# EAGLE design main (EAGLE 9.6.2)
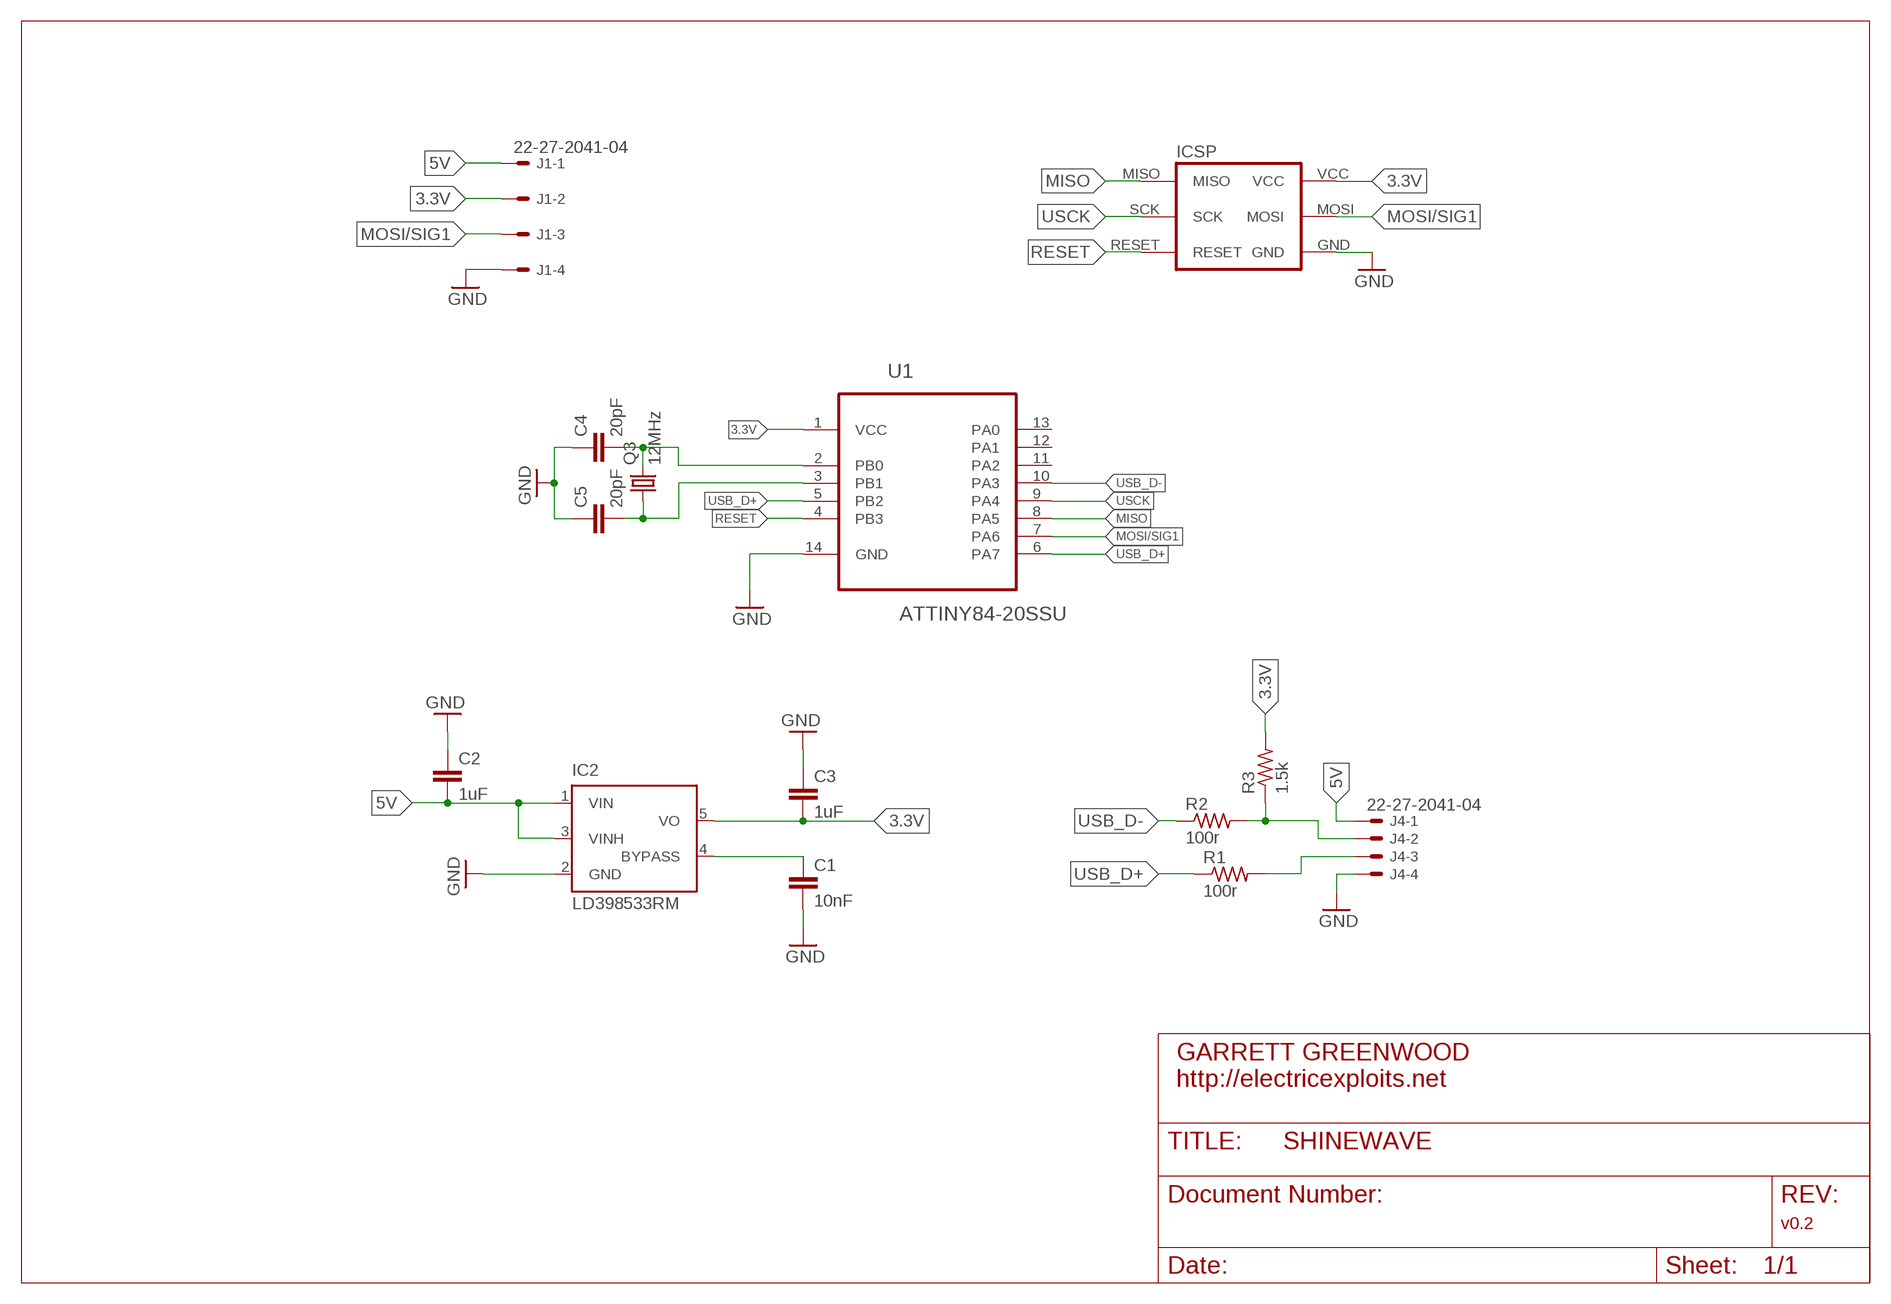
[diagram p0: schematic, sheet 1]

## Parts
C1  10nF  C-EUC0603  [C0603]
C2  1uF  C-EUC0603  [C0603]
C3  1uF  C-EUC0603  [C0603]
C4  20pF  C-EUC0603  [C0603]
C5  20pF  C-EUC0603  [C0603]
IC2  LD398533RM  [SOT23-5L]
J1  22-27-2041-04  [6410-04]
J4  22-27-2041-04  [6410-04]
Q3  12MHz  CRYSTALCTS406  [CTS406]
R1  100r  R-US_R0603  [R0603]
R2  100r  R-US_R0603  [R0603]
R3  1.5k  R-US_R0603  [R0603]
U1  ATTINY84-20SSU  [SOIC127P600X175-14N]
U$1  ICSP_POGO_INTERFACE  [ICSP_SMD]

## Nets
3.3V: C3.2 IC2.5(VO) J1.2 R3.2 U1.1(VCC) U$1.VCC
5V: C2.2 IC2.1(VIN) IC2.3(VINH) J1.1 J4.1
GND: C1.2 C2.1 C3.1 C4.1 C5.1 IC2.2(GND) J1.4 J4.4 U1.14(GND) U$1.GND
MISO: U1.8(PA5) U$1.MISO
MOSI/SIG1: J1.3 U1.7(PA6) U$1.MOSI
N$2: J4.2 R2.2 R3.1
N$4: C1.1 IC2.4(BYPASS)
N$5: J4.3 R1.2
RESET: U1.4(PB3) U$1.RESET
USB_D+: R1.1 U1.5(PB2) U1.6(PA7)
USB_D-: R2.1 U1.10(PA3)
USCK: U1.9(PA4) U$1.SCK
XTAL1: C4.2 Q3.3 U1.2(PB0)
XTAL2: C5.2 Q3.1 U1.3(PB1)
Unconnected: U1.11(PA2) U1.12(PA1) U1.13(PA0)

## Library data of the parts
C1-C5 = resistor:C-EU: CAPACITOR, European symbol
IC2 = st-microelectronics:LD3985: Ultra low drop and low noise BiCMOS voltage regulators Source: www.st.com LD3985.pdf
J1 J4 = con-molex:22-?-04: CONNECTOR wire to board 2.54 mm (.1 inch) pitch header; OC_FARNELL: unknown; OC_NEWARK: unknown
Q3 = crystal:CRYSTAL: CRYSTAL; OC_FARNELL: unknown; OC_NEWARK: unknown
R1-R3 = resistor:R-US_: RESISTOR, American symbol
U1 = Atmel_By_element14_Batch_1-00:ATTINY84-20SSU: 8-bit Microcontroller with Bytes In-System Programmable Flash; MPN: ATTINY84-20SSU; OC_FARNELL: 1636955; OC_NEWARK: 03P2040; PACKAGE: SOIC-14; SUPPLIER: Atmel
U$1 = shinewave:ICSP_POGO_INTERFACE: ICSP pads for programming over a pogo-pin interface.

## Board
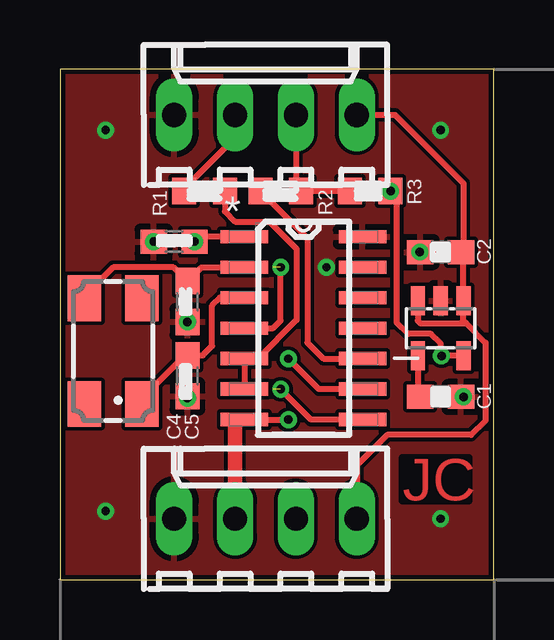
[diagram p1: board, top side]
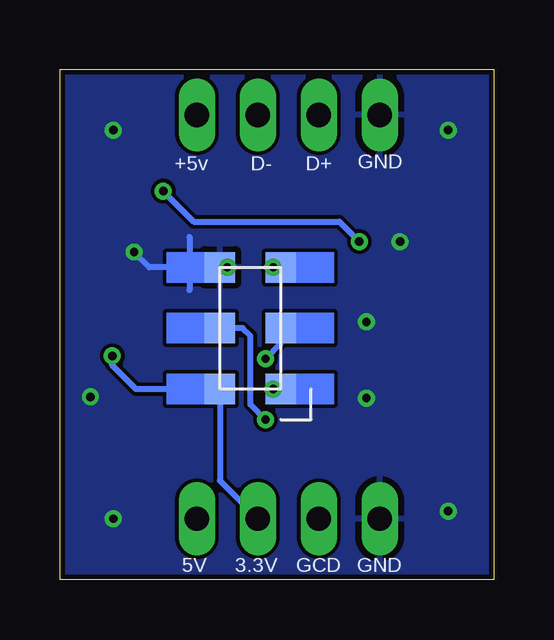
[diagram p2: board, bottom side, seen from below]

Size 18.1 x 21.26 mm. Coordinates in mm from the lower left corner, seen from the top.
Outline: 0,0 18.1,0 18.1,21.26 0,21.26 0,0
Copper layers (1*16): Top 0.0356mm / dielectric 1.5011mm / Bottom 0.0356mm
Design rules "LaenPCBOrder *": minimum track width 6mil, minimum drill 13mil, track to track 6mil, track to pad 6mil, pad to pad 6mil, via to via 6mil, smd to smd 6mil, copper to edge 8mil, drill to drill 6mil, minimum pad ring 7mil, minimum via ring 7mil, stop-mask expansion 3mil, vias tented up to drill 0mil, thermal gap 10mil

### Footprints (pad centres in the part's own frame; a part is rotated, then mirrored left to right if it is on the bottom)
C0603 = smd 1.1 x 1: 1 -0.85,0; 2 0.85,0
SOT23-5L = smd 0.6 x 1.2: 1 -0.95,-1.15; 2 0,-1.15; 3 0.95,-1.15; 4 0.95,1.15; 5 -0.95,1.15
6410-04 = drill 1.016 long: 1 3.81,0; 2 1.27,0; 3 -1.27,0; 4 -3.81,0
CTS406 = smd 1.9 x 1.4: 1 -2.2,-1.2; 2 2.2,-1.2; 3 2.2,1.2; 4 -2.2,1.2
R0603 = smd 1 x 1.1: 1 -0.85,0; 2 0.85,0
SOIC127P600X175-14N = smd 1.981 x 0.559: 1 -2.464,3.81; 2 -2.464,2.54; 3 -2.464,1.27; 4 -2.464,0; 5 -2.464,-1.27; 6 -2.464,-2.54; 7 -2.464,-3.81; 8 2.464,-3.81; 9 2.464,-2.54; 10 2.464,-1.27; 11 2.464,0; 12 2.464,1.27; 13 2.464,2.54; 14 2.464,3.81
ICSP_SMD = smd 1.27 x 1.27 bottom: GND 0,0; MISO 2.54,5.08; MOSI 0,2.54; RESET 2.54,0; SCK 2.54,2.54; VCC 0,5.08

### Placement (x,y rotation side)
C1  15.88,7.62 0 top
C2  15.88,13.65 0 top
C3  4.76,14.09 0 top
C4  5.32,11.59 90 top
C5  5.32,8.49 90 top
IC2  15.88,10.48 180 top
J1  8.57,2.54 0 top
J4  8.57,19.37 0 top
Q3  2.22,9.53 90 top
R1  6.03,16.19 180 top
R2  9.21,16.19 0 top
R3  12.94,16.19 0 top
U1  10.16,10.48 0 top
U$1  11.43,13.02 180 top

### Tracks (layer width: path | path; a pad name or v marks a point on that pad's centre or on a via)
3.3V  (via drill 0.35)
  Top 0.254: U1.1 5.81,14.29 C3.2 | IC2.5 v15.92,9.33 v15.91,9.33 15.88,9.37 15.88,9.84 15.48,10.24 14.53,10.24 14.05,10.72 14.05,15.93 R3.2
  Bottom 0.254: J1.2 11.43,4.13 U$1.VCC 14.92,7.94 15.91,8.93 v15.91,9.33 | R3.2 12.52,14.92 6.45,14.92 C3.2
  other vias: 13.79,16.19 5.61,14.09
5V
  Top 0.254: 16.82,13.23 IC2.1 16.83,10.79 | 16.82,13.23 16.82,13.55 C2.2 | IC2.3 14.93,10.8 14.92,10.79 15.04,10.68 16.71,10.68 | 16.71,10.68 16.83,10.79 | 16.83,10.79 16.95,10.68 | 16.95,10.68 17.74,9.88 17.74,6.63 17.14,6.03 13.65,6.03 12.38,4.76 J1.1 | J4.1 13.97,19.37 16.83,16.51 16.83,13.24 16.82,13.23 | 16.71,10.68 16.95,10.68
GND  (via drill 0.35)
  Top 0.254: 15.03,13.55 C2.1
  Bottom 0.254: U$1.GND 12.7,13.02 | 12.7,13.02 14.37,13.02 v15,13.65 | 12.7,14.29 12.7,13.02 | 12.7,13.02 12.7,12.06
  other vias: 16.83,7.62 3.91,14.09 5.32,10.74 5.32,7.56 11.11,13.02 1.91,2.86 15.88,2.54 15.88,18.73 1.91,18.73
  pour Bottom: 0,21.27 18.1,21.27 18.1,0 0,0
  pour Top: 0,21.27 18.1,21.27 18.1,0 0,0
MISO  (via drill 0.35)  (1 unrouted)
  Top 0.254: v9.21,7.94 10.48,6.67 U1.8
MOSI/SIG1  (via drill 0.35)
  Top 0.254: 7.3,6.59 7.38,6.67 U1.7 v9.53,6.67
  Top 0.61: J1.3 7.3,6.59
  Bottom 0.254: v9.53,6.67 10.16,7.3 10.16,10.16 10.48,10.48 U$1.MOSI
N$2
  Top 0.254: R3.1 R2.2 9.84,16.41 J4.2
N$4
  Top 0.254: IC2.4 14.93,7.72 C1.1
N$5
  Top 0.254: J4.3 7.3,18.41 5.08,16.19 R1.2
RESET  (via drill 0.35)  (1 unrouted)
  Top 0.254: U1.4 8.89,10.48 9.21,10.79 v9.21,13.02
USB_D+
  Top 0.254: U1.6 U1.5 8.26,9.21 9.87,10.82 9.87,13.79 8.73,14.92 7.3,14.92 6.88,15.34 R1.1
USB_D-
  Top 0.254: R2.1 10.32,14.23 10.32,9.88 10.99,9.21 U1.10
USCK  (via drill 0.35)
  Top 0.254: U1.9 10.79,7.94 v9.53,9.21
  Bottom 0.254: v9.53,9.21 8.89,9.84 U$1.SCK
XTAL1
  Top 0.254: U1.2 5.9,13.02 C4.2 4.74,13.02 2.22,13.02 1,11.79 1,11.7 Q3.3
XTAL2
  Top 0.254: Q3.1 3.42,7.55 5.22,9.34 C5.2 5.95,9.34 6.35,9.74 6.35,11.43 6.67,11.75 U1.3
(copper drawn outside any net)
  shapes: Bottom area x6

### Text on the board
Top: JC
bPlace: GND | D+ | D- | +5v | GND | GCD | 3.3V | 5V
tStop: JC